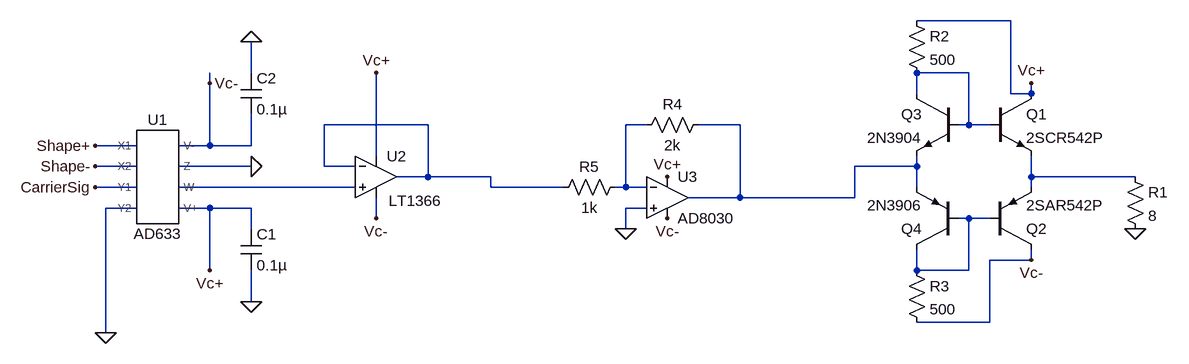
[diagram p0: schematic VCA+AmpBlockFinal.asc]
VCA+AmpBlockFinal.asc, the LTspice schematic file:
Version 4
SHEET 1 1432 680
WIRE 800 -80 656 -80
WIRE -368 0 -368 -48
WIRE 736 0 656 0
WIRE -432 16 -432 0
WIRE 656 32 656 0
WIRE 800 32 800 -80
WIRE 832 32 832 16
WIRE 832 32 800 32
WIRE -96 80 -256 80
WIRE 240 80 208 80
WIRE 384 80 320 80
WIRE 736 80 736 0
WIRE 736 80 720 80
WIRE 768 80 736 80
WIRE -544 112 -608 112
WIRE -432 112 -432 16
WIRE -432 112 -480 112
WIRE -368 112 -368 64
WIRE -368 112 -432 112
WIRE -176 128 -176 0
WIRE -544 144 -608 144
WIRE -368 144 -480 144
WIRE -256 144 -256 80
WIRE -208 144 -256 144
WIRE 656 144 656 128
WIRE 656 144 560 144
WIRE -96 160 -96 80
WIRE -96 160 -144 160
WIRE 0 160 -96 160
WIRE 832 160 832 128
WIRE 992 160 832 160
WIRE -544 176 -608 176
WIRE -208 176 -480 176
WIRE 0 176 0 160
WIRE 112 176 0 176
WIRE 208 176 208 80
WIRE 208 176 192 176
WIRE 240 176 208 176
WIRE 656 176 656 144
WIRE 832 176 832 160
WIRE 384 192 384 80
WIRE 384 192 304 192
WIRE 560 192 560 144
WIRE 560 192 384 192
WIRE -544 208 -592 208
WIRE -432 208 -480 208
WIRE -368 208 -432 208
WIRE 240 208 208 208
WIRE -176 224 -176 192
WIRE 736 224 720 224
WIRE 768 224 736 224
WIRE -368 240 -368 208
WIRE 208 240 208 208
WIRE 832 288 832 272
WIRE 832 288 768 288
WIRE -432 304 -432 208
WIRE 656 304 656 272
WIRE 736 304 736 224
WIRE 736 304 656 304
WIRE -368 352 -368 304
WIRE 768 384 768 288
WIRE 768 384 656 384
WIRE -592 400 -592 208
FLAG -432 304 Vc+
FLAG -432 16 Vc-
FLAG -592 400 0
FLAG -368 352 0
FLAG -368 -48 0
FLAG -368 144 0
FLAG -176 224 Vc-
FLAG -176 0 Vc+
FLAG 992 240 0
FLAG 832 16 Vc+
FLAG 832 288 Vc-
FLAG 272 160 Vc+
FLAG 272 224 Vc-
FLAG 208 240 0
FLAG -608 112 Shape+
FLAG -608 144 Shape-
FLAG -608 176 CarrierSig
SYMBOL AutoGenerated\\AD633 -512 160 R0
SYMATTR InstName U1
SYMBOL cap -384 240 R0
SYMATTR InstName C1
SYMATTR Value 0.1µ
SYMBOL cap -384 0 R0
SYMATTR InstName C2
SYMATTR Value 0.1µ
SYMBOL Opamps\\LT1366 -176 96 R0
WINDOW 3 19 101 Left 2
SYMATTR InstName U2
SYMBOL npn 768 32 R0
SYMATTR InstName Q1
SYMATTR Value 2SCR542P
SYMBOL pnp 768 272 M180
SYMATTR InstName Q2
SYMATTR Value 2SAR542P
SYMBOL res 976 144 R0
SYMATTR InstName R1
SYMATTR Value 8
SYMBOL npn 720 32 M0
SYMATTR InstName Q3
SYMATTR Value 2N3904
SYMBOL pnp 720 272 R180
SYMATTR InstName Q4
SYMATTR Value 2N3906
SYMBOL res 640 -96 R0
SYMATTR InstName R2
SYMATTR Value 500
SYMBOL res 640 288 R0
SYMATTR InstName R3
SYMATTR Value 500
SYMBOL res 336 64 R90
WINDOW 0 0 56 VBottom 2
WINDOW 3 32 56 VTop 2
SYMATTR InstName R4
SYMATTR Value 2k
SYMBOL res 208 160 R90
WINDOW 0 0 56 VBottom 2
WINDOW 3 32 56 VTop 2
SYMATTR InstName R5
SYMATTR Value 1k
SYMBOL Opamps\\AD8030 272 128 R0
SYMATTR InstName U3

The netlist it stands for:
* VCA+AmpBlockFinal.asc
XU1 Shape+ Shape- CarrierSig 0 Vc- 0 N006 Vc+ AD633  ; pins X1 X2 Y1 Y2 V- Z W V+
C1 Vc+ 0 0.1µ
C2 0 Vc- 0.1µ
XU2 N006 N002 Vc+ Vc- N002 LT1366  ; pins In+ In- V+ V- OUT
Q1 Vc+ N001 N005 0 2SCR542P
Q2 Vc- N007 N005 0 2SAR542P
R1 N005 0 8
Q3 N001 N001 N004 0 2N3904
Q4 N007 N007 N004 0 2N3906
R2 Vc+ N001 500
R3 N007 Vc- 500
R4 N004 N003 2k
R5 N003 N002 1k
XU3 0 N003 Vc+ Vc- N004 AD8040  ; AD8030, pins In+ In- V+ V- OUT
.model NPN NPN
.model PNP PNP
.lib standard.bjt
.lib C:\Users\hp\Documents\GitHub\EEE-Summer-Project-2020\AD633_imported.log
.lib LTC.lib
.lib ADI.lib
.backanno
.end